# Altium project B153BA.PrjPcb
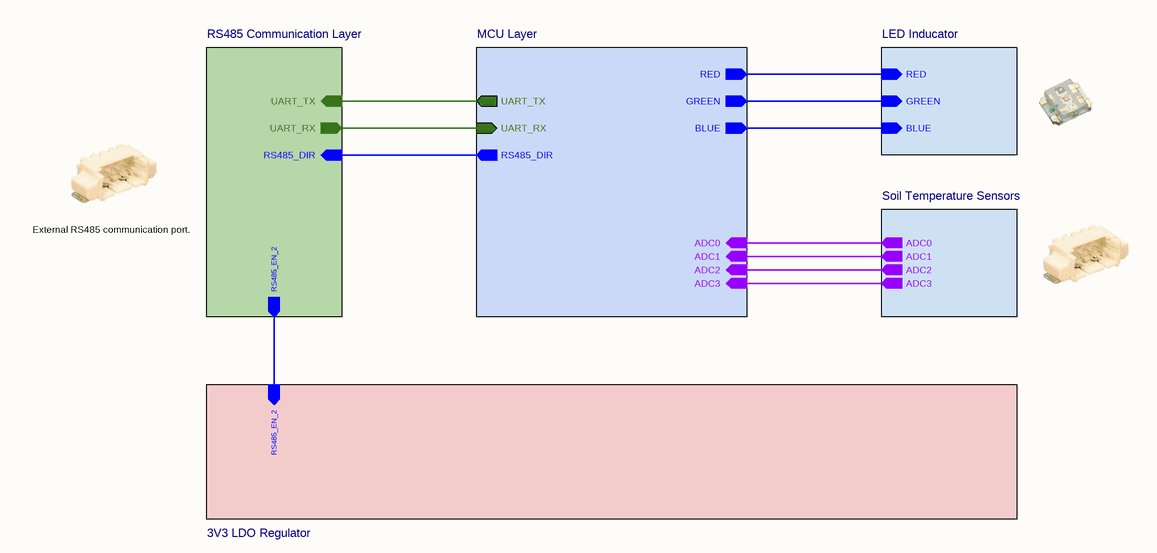
[diagram p0: Block_Diagram.SchDoc]
Address1_: Buyuk Kayacik Mah. 4. OSB; Address2_: 103. Cad. No : 12; Address3_: Selcuklu / Konya; Address4_: Türkiye; Copyright_: Copyright 2022 STF Tarim (Commercial Secret); Customer_: STF Irrigation; Engineer_: Gunce Akkoyun; Git_Repo_Address_: www.github.com/akkoyun/B153AA; Module_ID_: B153AA; Organization_: STF Res-Dev; Product_Desc_: P101DA; Product_ID_: P101DA; Revision_: 00.00.01; Version_: R1
6 sheets, 54 parts. Net scope: hierarchical (ports join the sheet entries above them; power ports are global).
Board file: B153BA.PcbDoc
Sheets:
  Block_Diagram.SchDoc
    RS485 Communication Layer = RS485 Communication Layer.SchDoc
    MCU Layer = MicroController.SchDoc
    Soil Temperature Sensors = Soil Temperature Sensors.SchDoc
    LED Inducator = LED Inducator.SchDoc
    3V3 LDO Regulator = 3V3 LDO Regulator.SchDoc

## Sheet Block_Diagram.SchDoc: B153AA Block Diagram
size 292 x 193 mm; SheetNumber: 1; SheetTotal: 6

### Sub-sheets
3V3 LDO Regulator = 3V3 LDO Regulator.SchDoc: RS485_EN_2 (in)
LED Inducator = LED Inducator.SchDoc: RED (in), BLUE (in), GREEN (in)
MCU Layer = MicroController.SchDoc: UART_TX (out), UART_RX (in), RS485_DIR (out), GREEN (out), RED (out), BLUE (out), ADC1 (in), ADC0 (in), ADC2 (in), ADC3 (in)
RS485 Communication Layer = RS485 Communication Layer.SchDoc: RS485_DIR (in), UART_RX (out), UART_TX (in), RS485_EN_2 (out)
Soil Temperature Sensors = Soil Temperature Sensors.SchDoc: ADC0 (out), ADC1 (out), ADC3 (out), ADC2 (out)

### Nets
ADC0: sheet MCU Layer/ADC0, sheet Soil Temperature Sensors/ADC0
ADC1: sheet MCU Layer/ADC1, sheet Soil Temperature Sensors/ADC1
ADC2: sheet MCU Layer/ADC2, sheet Soil Temperature Sensors/ADC2
ADC3: sheet MCU Layer/ADC3, sheet Soil Temperature Sensors/ADC3
BLUE: sheet MCU Layer/BLUE, sheet LED Inducator/BLUE
GREEN: sheet MCU Layer/GREEN, sheet LED Inducator/GREEN
RED: sheet MCU Layer/RED, sheet LED Inducator/RED
RS485_DIR: sheet RS485 Communication Layer/RS485_DIR, sheet MCU Layer/RS485_DIR
RS485_EN_2: sheet RS485 Communication Layer/RS485_EN_2, sheet 3V3 LDO Regulator/RS485_EN_2
UART_RX: sheet RS485 Communication Layer/UART_RX, sheet MCU Layer/UART_RX
UART_TX: sheet RS485 Communication Layer/UART_TX, sheet MCU Layer/UART_TX

### Notes on the sheet
- External RS485 communication port.
- © 2021 All rights reserved.
  This document may not, in whole or in part, be copied, photocopied, reproduced, translated or converted to any electronic or machine readable from without prior written permission of Mehmet Günce Akkoyun.
  Engineer contact : akkoyun@me.com
- Property of
- Engineer :
- Date :
- Size :
- A4
- Time :
- Project :
- Page :
- /
- Customer :
- Product ID :
- Module ID :
- Version :
- File :
- Revision :

## Sheet RS485 Communication Layer.SchDoc: RS485 Communication Layer
size 292 x 193 mm; SheetNumber: 2; SheetTotal: 5
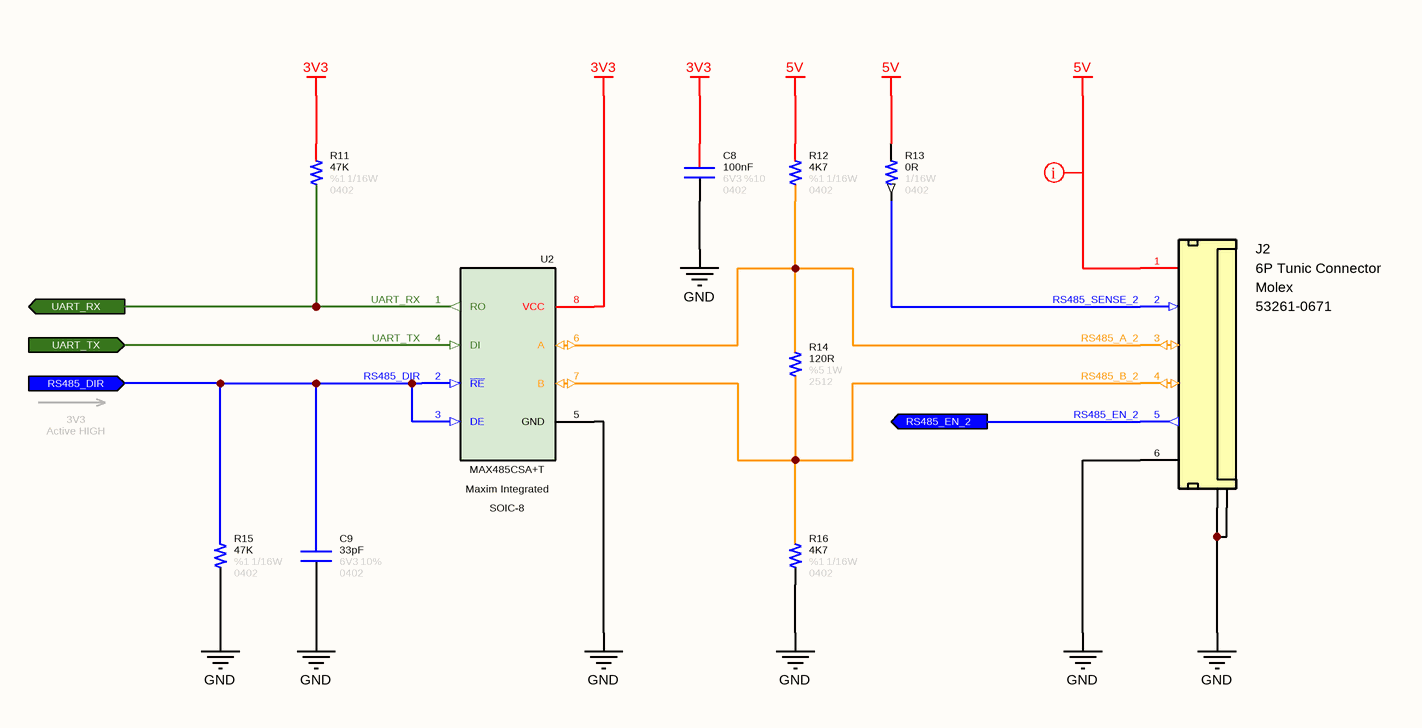
[diagram p1: RS485 Communication Layer.SchDoc]

### Parts
C8  value 100nF  Tolerance: %10  Voltage: 6V3  Case: 0402  [CAPACITOR_0402]  (hidden comment: Capacitor - 100nF [0402] (Ceramic))
C9  value 33pF  Tolerance: 10%  Case: 0402  Voltage: 6V3  [CAPACITOR_0402]  (hidden comment: Capacitor - 33pF [0402] (Ceramic))
J2  6P Tunic Connector  Manufacturer Part Number: 53261-0671  Manufacturer Name: Molex  [Connector_Tunic 6P]
R11  value 47K  Tolerance: %1  Case: 0402  Power: 1/16W  [RESISTOR_0402]  (hidden comment: 47K - 0402 - %1 - 1/16W)
R12  value 4K7  Tolerance: %1  Case: 0402  Power: 1/16W  [RESISTOR_0402]  (hidden comment: 4K7 - 0402 - %1 - 1/16W)
R13  value 0R  Case: 0402  Power: 1/16W  [RESISTOR_0402]  (hidden comment: 0R - 0402 - %1 - 1/16W)
R14  value 120R  Tolerance: %5  Case: 2512  Power: 1W  [RESISTOR_2512]  (hidden comment: 120R - 2512 - %5 - 1W)
R15  value 47K  Tolerance: %1  Case: 0402  Power: 1/16W  [RESISTOR_0402]  (hidden comment: 47K - 0402 - %1 - 1/16W)
R16  value 4K7  Tolerance: %1  Case: 0402  Power: 1/16W  [RESISTOR_0402]  (hidden comment: 4K7 - 0402 - %1 - 1/16W)
U2  Case: SOIC-8  Manufacturer Part Number: MAX485CSA+T  Manufacturer Name: Maxim Integrated  [SOP-8L (AZRS3080E)]  (hidden comment: RS485 Modulator)

### Ports
RS485_DIR (in), RS485_EN_2 (out), UART_RX (out), UART_TX (in)

### Nets
3V3: C8.2 R11.2 U2.8(VCC)
5V: J2.1(5V) R12.2 R13.2
GND: C8.1 C9.1 J2.6(GND) J2.7(GND) J2.8(GND) R15.1 R16.1 U2.5(GND)
RS485_A_2: J2.3(RS485-A) R12.1 R14.2 U2.6(A)
RS485_B_2: J2.4(RS485-B) R14.1 R16.2 U2.7(B)
RS485_DIR: C9.2 R15.2 U2.2(~{RE}) U2.3(DE) ; port RS485_DIR
RS485_EN_2: J2.5(INT) ; port RS485_EN_2
RS485_SENSE_2: J2.2(Sense) R13.1
UART_RX: R11.1 U2.1(RO) ; port UART_RX
UART_TX: U2.4(DI) ; port UART_TX

### Layout directives
rule Supply Nets [Voltage = 5.000]: 5V

### Notes on the sheet
- 3V3
  Active HIGH
- © 2021 All rights reserved.
  This document may not, in whole or in part, be copied, photocopied, reproduced, translated or converted to any electronic or machine readable from without prior written permission of Mehmet Günce Akkoyun.
  Engineer contact : akkoyun@me.com
- Property of
- Engineer :
- Date :
- Size :
- A4
- Time :
- Project :
- Page :
- /
- Customer :
- Product ID :
- Module ID :
- Version :
- File :
- Revision :

### Library data of the parts
C8 = Capacitor - 100nF [0402-6V3]: Capacitor - 100nF [0402-6V3] (Ceramic); Manufacturer Name: AVX; Manufacturer Part Number: 04026D104KAT4A; ComponentLink1Description: Mouser; ComponentLink1URL: https://www.mouser.com.tr/ProductDetail/AVX/04026D104KAT4A?qs=sGAEpiMZZMs0AnBnWHyRQPg4iYkCw7IMED%2F4kpqgf7w%3D; ComponentLink2Description: DataSheet; ComponentLink2URL: https://www.mouser.com.tr/datasheet/2/40/cx5r-776519.pdf
C9 = Capacitor - 33pF [0402-6V3]: Manufacturer Name: Kemet; Manufacturer Part Number: C0402C330J9RACAUTO; ComponentLink1Description: DataSheet; ComponentLink1URL: https://api.kemet.com/component-edge/download/datasheet/C0402C330J9RACAUTO.pdf; ComponentLink2Description: Mouser; ComponentLink2URL: https://www.mouser.com/Search/Refine.aspx?Keyword=80-C0402C330J9RAUTO
J2 = Connector - Mini Tunic 6P (1.25): Mini Tunic Connector with 6P; ROHS: Yes; System: Connector
R11 R15 = Resistor - 47K [0402]: Thick Film Resistors - SMD 1/16 W 47 KOhm 1%; Manufacturer Name: Vishay; Manufacturer Part Number: CRCW040247K0FKED; ComponentLink1Description: DataSheet; ComponentLink1URL: https://www.mouser.com.tr/datasheet/2/427/dcrcwe3-1762152.pdf; ComponentLink2Description: Mouser; ComponentLink2URL: https://www.mouser.com.tr/ProductDetail/Vishay-Dale/CRCW040247K0FKED?qs=sGAEpiMZZMu61qfTUdNhG2DpbjADlD3GL%252B3h1elTxqU%3D
R12 R16 = Resistor - 4K7 [0402]: Thick Film Resistors - SMD 1/16 W 4.7 KOhm 1%; Manufacturer Name: Vishay; Manufacturer Part Number: CRCW04024K70FKED; ComponentLink1Description: DataSheet; ComponentLink1URL: https://www.mouser.com.tr/datasheet/2/427/dcrcwe3-1762152.pdf; ComponentLink2Description: Mouser; ComponentLink2URL: https://www.mouser.com.tr/ProductDetail/Vishay-Dale/CRCW04024K70FKED?qs=sGAEpiMZZMu61qfTUdNhG7nHf%2F6MTUn3HadIdDQu24Q%3D
R13 = Resistor - 0R [0402]: Thick Film Resistors - SMD 1/16 W 0 Ohm; Manufacturer Name: Vishay; Manufacturer Part Number: CRCW04020000Z0ED; ComponentLink1Description: DataSheet; ComponentLink1URL: https://www.mouser.com.tr/datasheet/2/427/dcrcwe3-1762152.pdf; ComponentLink2Description: Mouser; ComponentLink2URL: https://www.mouser.com.tr/ProductDetail/Vishay-Dale/CRCW04020000Z0ED?qs=sGAEpiMZZMu61qfTUdNhG2DpbjADlD3GG34cJb50zyg%3D
R14 = Resistor - 120R [2512]: Thick Film Resistors - SMD 1 W 120 Ohm 5%; Manufacturer Name: YAGEO; Manufacturer Part Number: RC2512JK-07120RL; ComponentLink1Description: DataSheet; ComponentLink1URL: https://www.mouser.com.tr/datasheet/2/447/PYu_RC_Group_51_RoHS_L_11-1984063.pdf
U2 = IC - MAX485CSA+T: RS-422/RS-485 Interface IC Low-Power, Slew-Rate-Limited RS-485/RS-422 Transceivers; RoHS: Yes

## Sheet MicroController.SchDoc: MicroController
size 292 x 193 mm; SheetNumber: 4; SheetTotal: 6
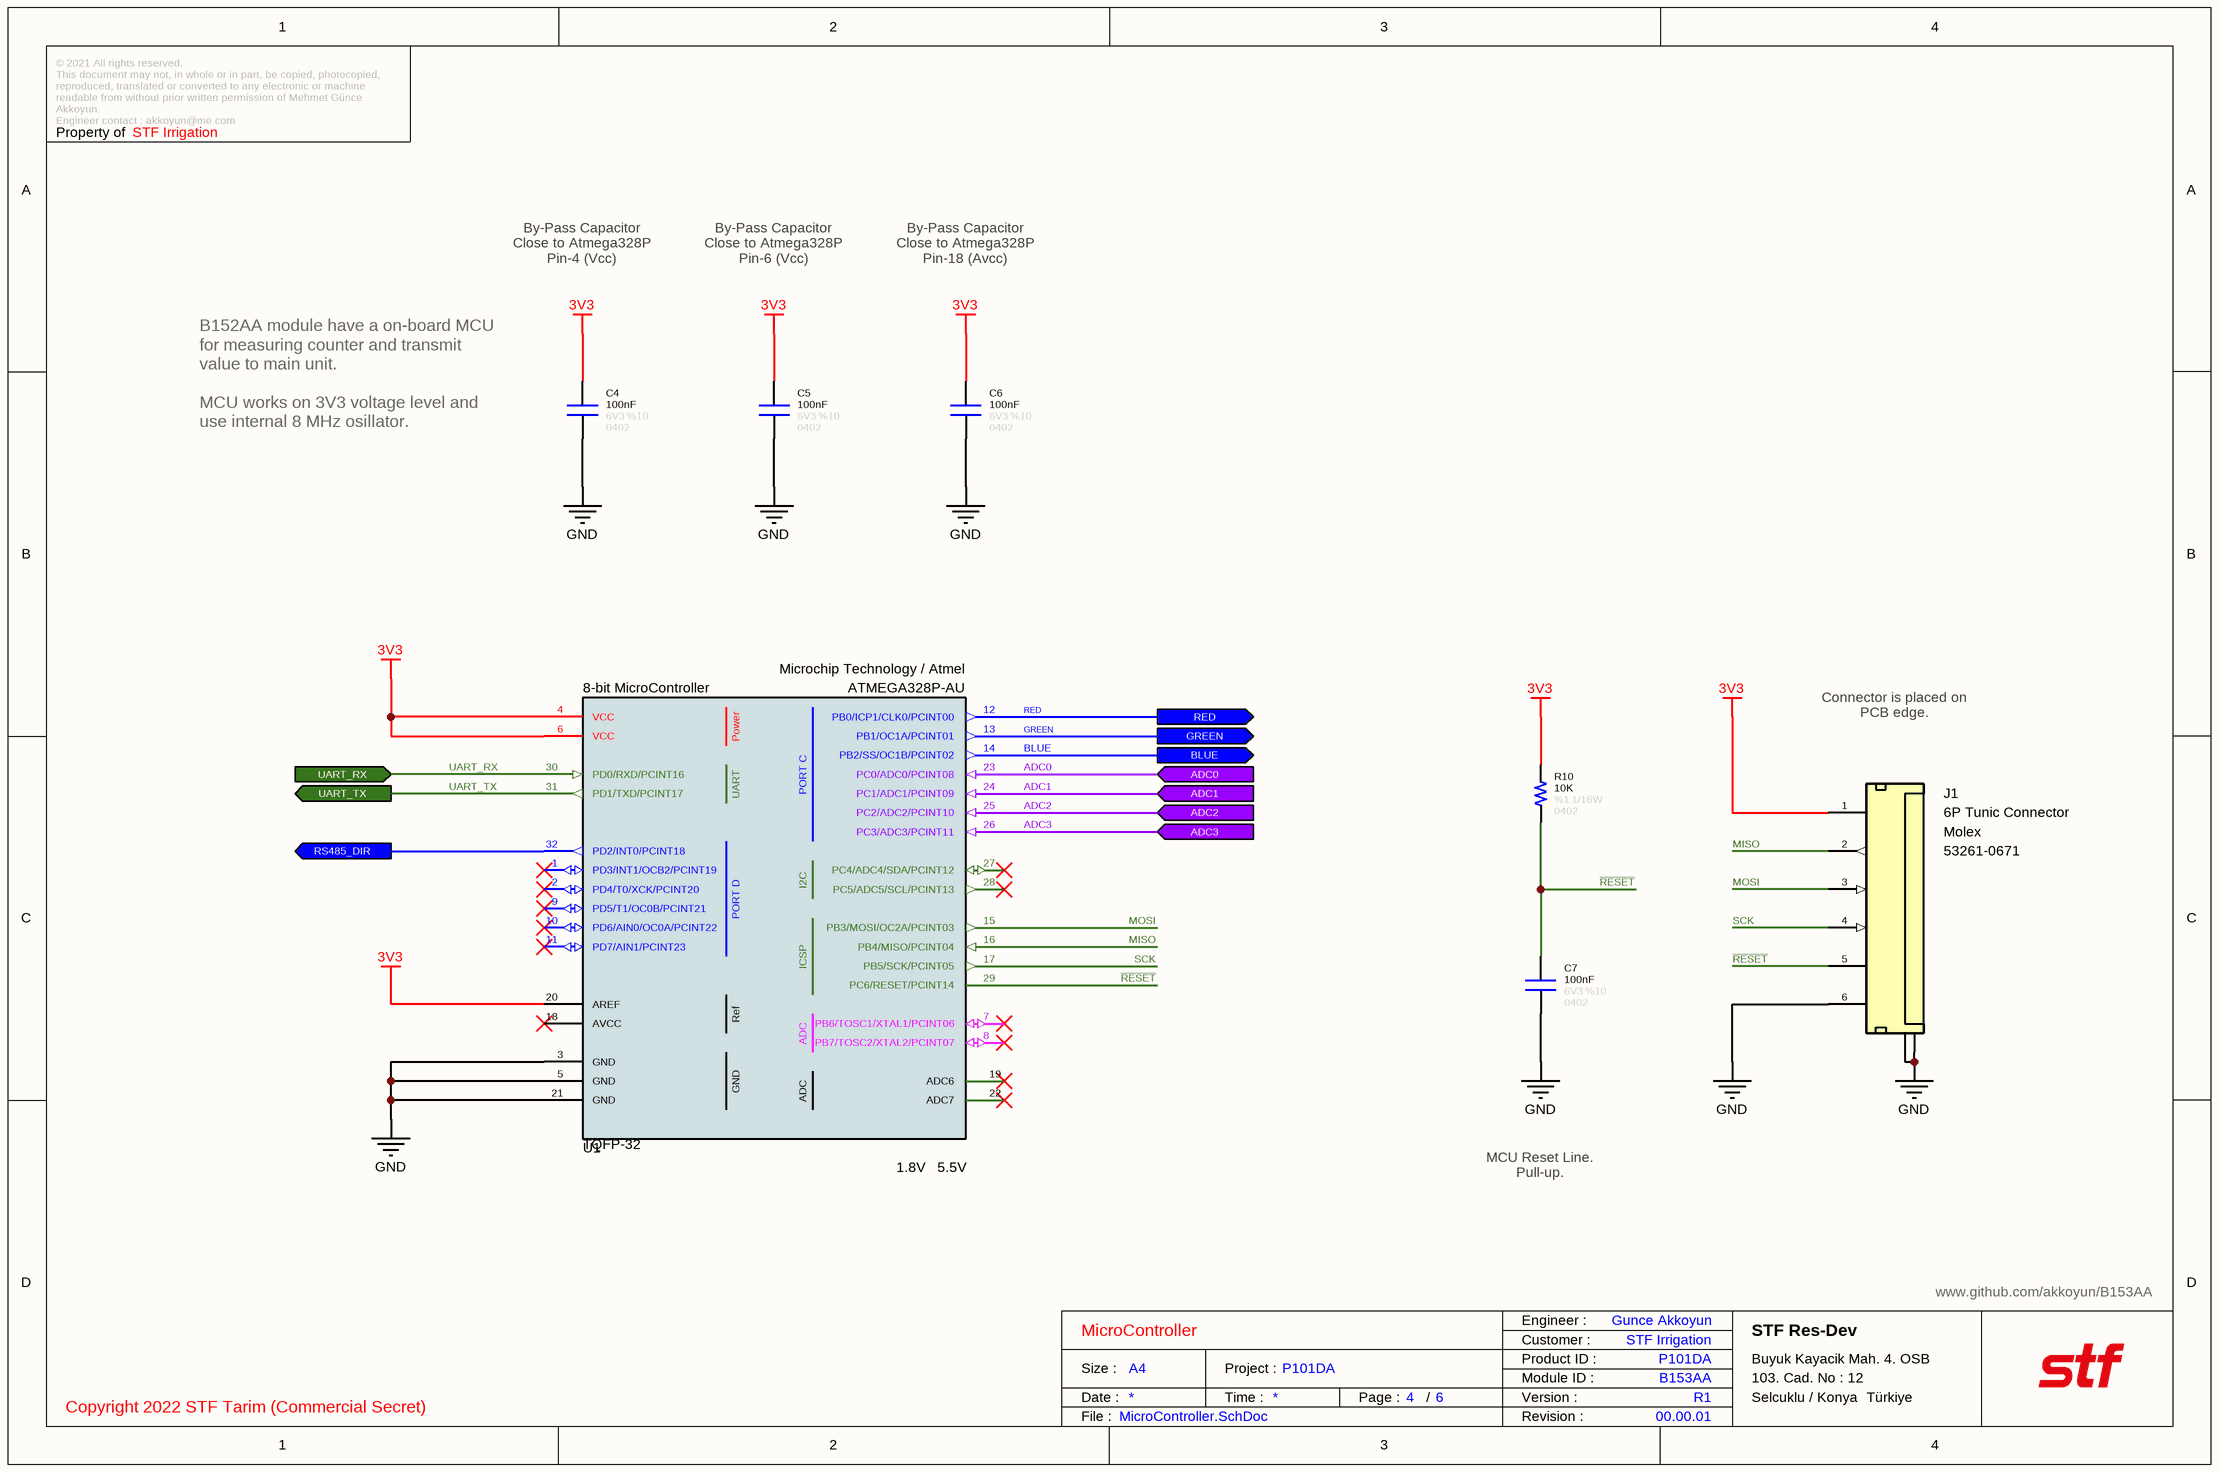
[diagram p2: MicroController.SchDoc]

### Parts
C4  value 100nF  Tolerance: %10  Voltage: 6V3  Case: 0402  [CAPACITOR_0402]  (hidden comment: Capacitor - 100nF [0402] (Ceramic))
C5  value 100nF  Tolerance: %10  Voltage: 6V3  Case: 0402  [CAPACITOR_0402]  (hidden comment: Capacitor - 100nF [0402] (Ceramic))
C6  value 100nF  Tolerance: %10  Voltage: 6V3  Case: 0402  [CAPACITOR_0402]  (hidden comment: Capacitor - 100nF [0402] (Ceramic))
C7  value 100nF  Tolerance: %10  Voltage: 6V3  Case: 0402  [CAPACITOR_0402]  (hidden comment: Capacitor - 100nF [0402] (Ceramic))
J1  6P Tunic Connector  Manufacturer Part Number: 53261-0671  Manufacturer Name: Molex  [Connector_Tunic 6P]
R10  value 10K  Tolerance: %1  Case: 0402  Power: 1/16W  [RESISTOR_0402]  (hidden comment: 10K - 0402 - %1 - 1/16W)
U1  8-bit MicroController  Supply Voltage - Max: 5.5V  Supply Voltage - Min: 1.8V  Manufacturer Name: Microchip Technology / Atmel  Manufacturer Part Number: ATMEGA328P-AU  Case: TQFP-32  [TQFN-32]

### Ports
ADC0 (in), ADC1 (in), ADC2 (in), ADC3 (in), BLUE (out), GREEN (out), RED (out), RS485_DIR (out), UART_RX (in), UART_TX (out)

### Nets
3V3: C4.2 C5.2 C6.2 J1.1(VBAT) R10.2 U1.4(VCC) U1.6(VCC) U1.20(AREF)
GND: C4.1 C5.1 C6.1 C7.1 J1.6(M_DRV) J1.7(GND) J1.8(GND) U1.3(GND) U1.5(GND) U1.21(GND)
ADC0: U1.23(PC0/ADC0/PCINT08) ; port ADC0
ADC1: U1.24(PC1/ADC1/PCINT09) ; port ADC1
ADC2: U1.25(PC2/ADC2/PCINT10) ; port ADC2
ADC3: U1.26(PC3/ADC3/PCINT11) ; port ADC3
BLUE: U1.14(PB2/SS/OC1B/PCINT02) ; port BLUE
GREEN: U1.13(PB1/OC1A/PCINT01) ; port GREEN
MISO: J1.2(M_DRV) U1.16(PB4/MISO/PCINT04)
MOSI: J1.3(M_DRV) U1.15(PB3/MOSI/OC2A/PCINT03)
~{RESET}: C7.2 J1.5(M_DRV) R10.1 U1.29(PC6/RESET/PCINT14)
RED: U1.12(PB0/ICP1/CLK0/PCINT00) ; port RED
RS485_DIR: U1.32(PD2/INT0/PCINT18) ; port RS485_DIR
SCK: J1.4(M_DRV) U1.17(PB5/SCK/PCINT05)
UART_RX: U1.30(PD0/RXD/PCINT16) ; port UART_RX
UART_TX: U1.31(PD1/TXD/PCINT17) ; port UART_TX

Not connected (* = marked no-connect by the designer): U1 1(PD3/INT1/OCB2/PCINT19)* 2(PD4/T0/XCK/PCINT20)* 7(PB6/TOSC1/XTAL1/PCINT06)* 8(PB7/TOSC2/XTAL2/PCINT07)* 9(PD5/T1/OC0B/PCINT21)* 10(PD6/AIN0/OC0A/PCINT22)* 11(PD7/AIN1/PCINT23)* 18(AVCC)* 19(ADC6)* 22(ADC7)* 27(PC4/ADC4/SDA/PCINT12)* 28(PC5/ADC5/SCL/PCINT13)*

### Notes on the sheet
- By-Pass Capacitor
  Close to Atmega328P
  Pin-4 (Vcc)
- By-Pass Capacitor
  Close to Atmega328P
  Pin-6 (Vcc)
- By-Pass Capacitor
  Close to Atmega328P
  Pin-18 (Avcc)
- B152AA module have a on-board MCU for measuring counter and transmit value to main unit.
  MCU works on 3V3 voltage level and use internal 8 MHz osillator.
- Connector is placed on PCB edge.
- MCU Reset Line. Pull-up.
- © 2021 All rights reserved.
  This document may not, in whole or in part, be copied, photocopied, reproduced, translated or converted to any electronic or machine readable from without prior written permission of Mehmet Günce Akkoyun.
  Engineer contact : akkoyun@me.com
- Property of
- Engineer :
- Date :
- Size :
- A4
- Time :
- Project :
- Page :
- /
- Customer :
- Product ID :
- Module ID :
- Version :
- File :
- Revision :
- (in symbol IC - ATMEGA328P-AU) Power; PORT C; UART; I2C; PORT D; ICSP; Ref; ADC

### Library data of the parts
C4-C7 = Capacitor - 100nF [0402-6V3]: as C8 on sheet RS485 Communication Layer; ComponentLink1Description: Mouser; ComponentLink1URL: https://www.mouser.com.tr/ProductDetail/AVX/04026D104KAT4A?qs=sGAEpiMZZMs0AnBnWHyRQPg4iYkCw7IMED%2F4kpqgf7w%3D; ComponentLink2Description: DataSheet; ComponentLink2URL: https://www.mouser.com.tr/datasheet/2/40/cx5r-776519.pdf
J1 = Connector - Mini Tunic 6P (1.25): Mini Tunic Connector with 6P; ROHS: Yes
R10 = Resistor - 10K [0402]: Thick Film Resistors - SMD 1/16 W 10 KOhm 1%; Manufacturer Name: Vishay; Manufacturer Part Number: CRCW040210K0FKED; ComponentLink1Description: DataSheet; ComponentLink1URL: https://www.mouser.com.tr/datasheet/2/427/dcrcwe3-1762152.pdf; ComponentLink2Description: Mouser; ComponentLink2URL: https://www.mouser.com.tr/ProductDetail/Vishay-Dale/CRCW040210K0FKED?qs=sGAEpiMZZMu61qfTUdNhG2DpbjADlD3GcalbOv9utCY%3D
U1 = IC - ATMEGA328P-AU: 8-bit Microcontrollers - MCU 32KB In-system Flash 20MHz 1.8V-5.5V; Height: 1mm; ComponentLink1Description: DataSheet; ComponentLink1URL: http://ww1.microchip.com/downloads/en/DeviceDoc/ATmega48A-PA-88A-PA-168A-PA-328-P-DS-DS40002061A.pdf; ROHS: Yes; Minimum Operating Temperature: -40; Maximum Operating Temperature: +85; ComponentLink2Description: Mouser; ComponentLink2URL: https://www.mouser.com.tr/ProductDetail/Microchip-Technology-Atmel/ATMEGA328P-AU?qs=sGAEpiMZZMtVoztFdqDXO3RbBx7FKCmV; ComponentLink3Description: ProductPage; ComponentLink3URL: https://www.microchip.com/wwwproducts/en/ATmega328p

## Sheet Soil Temperature Sensors.SchDoc: Soil Temperature Sensors
size 292 x 193 mm; SheetNumber: 6; SheetTotal: 5
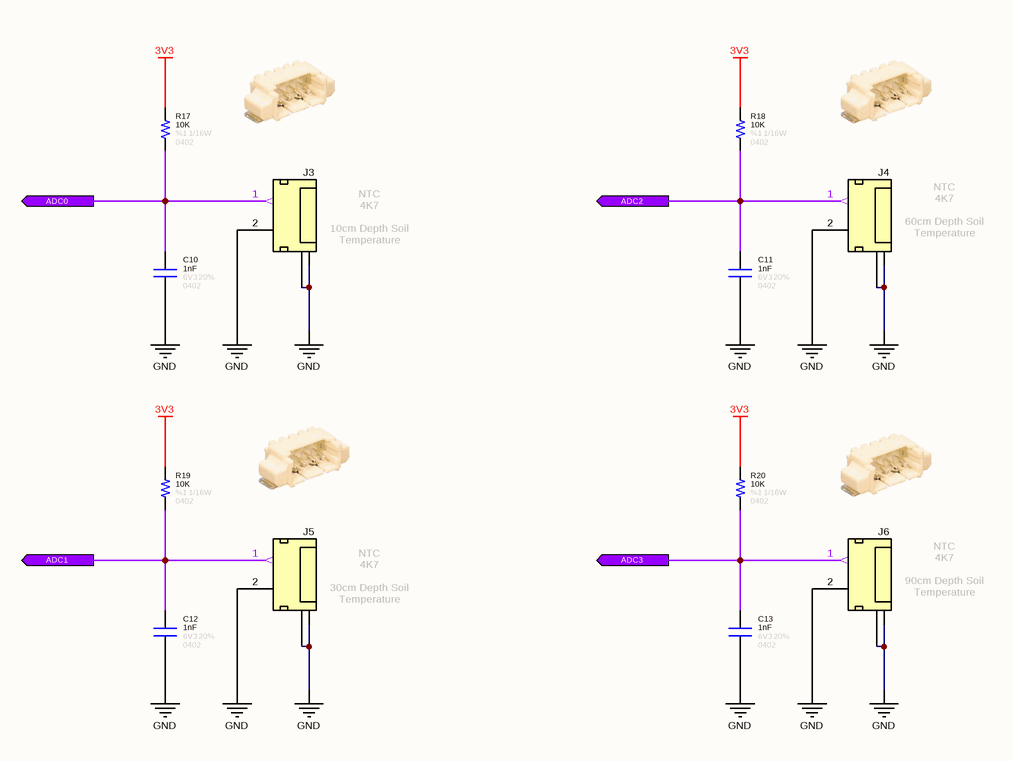
[diagram p3: Soil Temperature Sensors.SchDoc]

### Parts
C10  value 1nF  Tolerance: 20%  Case: 0402  Voltage: 6V3  [CAPACITOR_0402]  (hidden comment: Capacitor - 1nF [0402] (Ceramic))
C11  value 1nF  Tolerance: 20%  Case: 0402  Voltage: 6V3  [CAPACITOR_0402]  (hidden comment: Capacitor - 1nF [0402] (Ceramic))
C12  value 1nF  Tolerance: 20%  Case: 0402  Voltage: 6V3  [CAPACITOR_0402]  (hidden comment: Capacitor - 1nF [0402] (Ceramic))
C13  value 1nF  Tolerance: 20%  Case: 0402  Voltage: 6V3  [CAPACITOR_0402]  (hidden comment: Capacitor - 1nF [0402] (Ceramic))
J3  2P SMD Tunic Connector  [Connector_Tunic 2P]  (value not drawn)
J4  2P SMD Tunic Connector  [Connector_Tunic 2P]  (value not drawn)
J5  2P SMD Tunic Connector  [Connector_Tunic 2P]  (value not drawn)
J6  2P SMD Tunic Connector  [Connector_Tunic 2P]  (value not drawn)
R17  value 10K  Tolerance: %1  Case: 0402  Power: 1/16W  [RESISTOR_0402]  (hidden comment: 10K - 0402 - %1 - 1/16W)
R18  value 10K  Tolerance: %1  Case: 0402  Power: 1/16W  [RESISTOR_0402]  (hidden comment: 10K - 0402 - %1 - 1/16W)
R19  value 10K  Tolerance: %1  Case: 0402  Power: 1/16W  [RESISTOR_0402]  (hidden comment: 10K - 0402 - %1 - 1/16W)
R20  value 10K  Tolerance: %1  Case: 0402  Power: 1/16W  [RESISTOR_0402]  (hidden comment: 10K - 0402 - %1 - 1/16W)

### Ports
ADC0 (out), ADC1 (out), ADC2 (out), ADC3 (out)

### Nets
3V3: R17.2 R18.2 R19.2 R20.2
GND: C10.1 C11.1 C12.1 C13.1 J3.2(Pin2) J3.3(GND) J3.4(GND) J4.2(Pin2) J4.3(GND) J4.4(GND) J5.2(Pin2) J5.3(GND) J5.4(GND) J6.2(Pin2) J6.3(GND) J6.4(GND)
ADC0: C10.2 J3.1(Pin1) R17.1 ; port ADC0
ADC1: C12.2 J5.1(Pin1) R19.1 ; port ADC1
ADC2: C11.2 J4.1(Pin1) R18.1 ; port ADC2
ADC3: C13.2 J6.1(Pin1) R20.1 ; port ADC3

### Notes on the sheet
- (near J3) NTC
  4K7
  10cm Depth Soil Temperature
- (near J4) NTC
  4K7
  60cm Depth Soil Temperature
- (near J5) NTC
  4K7
  30cm Depth Soil Temperature
- (near J6) NTC
  4K7
  90cm Depth Soil Temperature
- © 2021 All rights reserved.
  This document may not, in whole or in part, be copied, photocopied, reproduced, translated or converted to any electronic or machine readable from without prior written permission of Mehmet Günce Akkoyun.
  Engineer contact : akkoyun@me.com
- Property of
- Engineer :
- Date :
- Size :
- A4
- Time :
- Project :
- Page :
- /
- Customer :
- Product ID :
- Module ID :
- Version :
- File :
- Revision :

### Library data of the parts
C10-C13 = Capacitor - 1nF [0402-6V3]: Manufacturer Name: AVX; Manufacturer Part Number: 04026C102MAT2A; ComponentLink1Description: DataSheet; ComponentLink1URL: https://www.mouser.com.tr/datasheet/2/40/X7RDielectric-777024.pdf
J3-J6 = Connector - Mini Tunic 2P (1.25): Mini Tunic Connector with 2P; Manufacturer Name: Molex; Manufacturer Part Number: 53261-0271; Height: 3.55mm; Mouser Part Number: 538-53261-0271; ROHS: Yes
R17-R20 = Resistor - 10K [0402]: as R10 on sheet MicroController; ComponentLink1Description: DataSheet; ComponentLink1URL: https://www.mouser.com.tr/datasheet/2/427/dcrcwe3-1762152.pdf; ComponentLink2Description: Mouser; ComponentLink2URL: https://www.mouser.com.tr/ProductDetail/Vishay-Dale/CRCW040210K0FKED?qs=sGAEpiMZZMu61qfTUdNhG2DpbjADlD3GcalbOv9utCY%3D

## Sheet LED Inducator.SchDoc: MCU LED Layer
size 292 x 193 mm; SheetNumber: 5; SheetTotal: 5
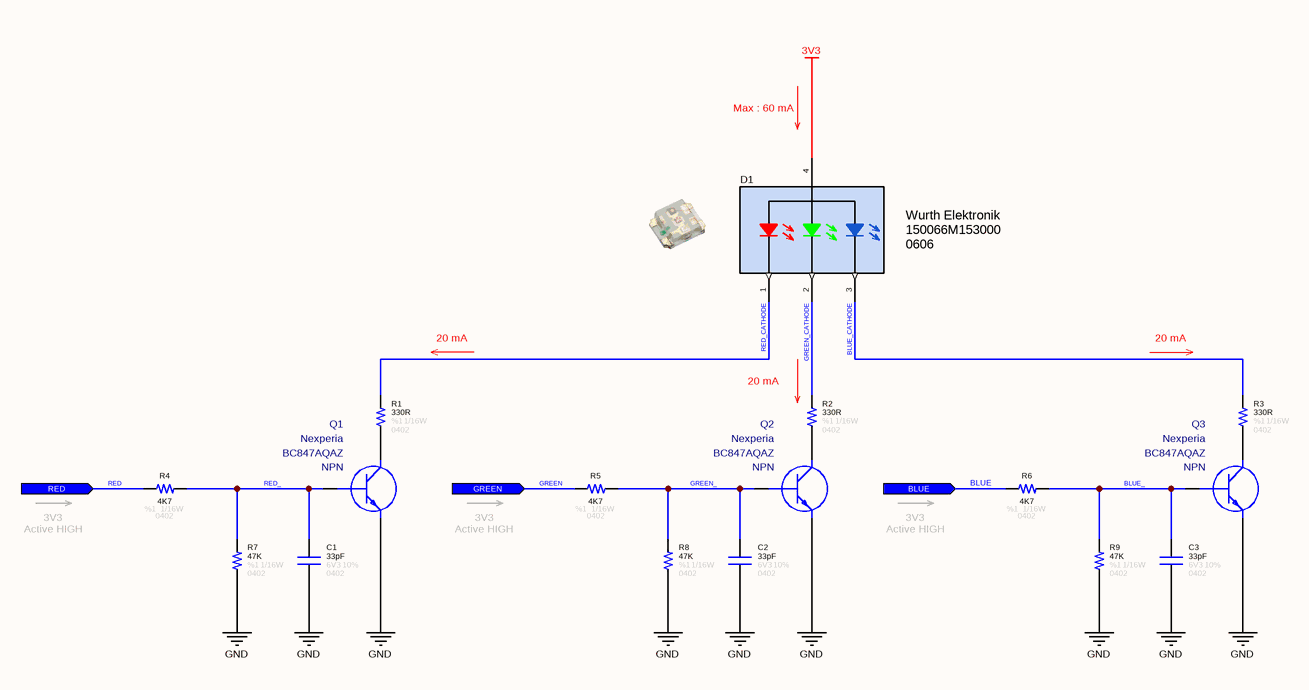
[diagram p4: LED Inducator.SchDoc]

### Parts
C1  value 33pF  Tolerance: 10%  Case: 0402  Voltage: 6V3  [CAPACITOR_0402]  (hidden comment: Capacitor - 33pF [0402] (Ceramic))
C2  value 33pF  Tolerance: 10%  Case: 0402  Voltage: 6V3  [CAPACITOR_0402]  (hidden comment: Capacitor - 33pF [0402] (Ceramic))
C3  value 33pF  Tolerance: 10%  Case: 0402  Voltage: 6V3  [CAPACITOR_0402]  (hidden comment: Capacitor - 33pF [0402] (Ceramic))
D1  Manufacturer Name: Wurth Elektronik  Case: 0606  [Wurth_0606]  (hidden comment: 150066M153000)
Q1  Manufacturer Name: Nexperia  Polarity: NPN  [SOT1215]  (hidden comment: BC847AQAZ)
Q2  Manufacturer Name: Nexperia  Polarity: NPN  [SOT1215]  (hidden comment: BC847AQAZ)
Q3  Manufacturer Name: Nexperia  Polarity: NPN  [SOT1215]  (hidden comment: BC847AQAZ)
R1  value 330R  Case: 0402  Tolerance: %1  Power: 1/16W  [RESISTOR_0402]  (hidden comment: 330R - 0402 - %1 - 1/16W)
R2  value 330R  Case: 0402  Tolerance: %1  Power: 1/16W  [RESISTOR_0402]  (hidden comment: 330R - 0402 - %1 - 1/16W)
R3  value 330R  Case: 0402  Tolerance: %1  Power: 1/16W  [RESISTOR_0402]  (hidden comment: 330R - 0402 - %1 - 1/16W)
R4  value 4K7  Tolerance: %1  Case: 0402  Power: 1/16W  [RESISTOR_0402]  (hidden comment: 4K7 - 0402 - %1 - 1/16W)
R5  value 4K7  Tolerance: %1  Case: 0402  Power: 1/16W  [RESISTOR_0402]  (hidden comment: 4K7 - 0402 - %1 - 1/16W)
R6  value 4K7  Tolerance: %1  Case: 0402  Power: 1/16W  [RESISTOR_0402]  (hidden comment: 4K7 - 0402 - %1 - 1/16W)
R7  value 47K  Tolerance: %1  Case: 0402  Power: 1/16W  [RESISTOR_0402]  (hidden comment: 47K - 0402 - %1 - 1/16W)
R8  value 47K  Tolerance: %1  Case: 0402  Power: 1/16W  [RESISTOR_0402]  (hidden comment: 47K - 0402 - %1 - 1/16W)
R9  value 47K  Tolerance: %1  Case: 0402  Power: 1/16W  [RESISTOR_0402]  (hidden comment: 47K - 0402 - %1 - 1/16W)

### Ports
BLUE (in), GREEN (in), RED (in)

### Nets
3V3: D1.4
GND: C1.1 C2.1 C3.1 Q1.2(E) Q2.2(E) Q3.2(E) R7.1 R8.1 R9.1
BLUE: R6.2 ; port BLUE
BLUE_: C3.2 Q3.1(B) R6.1 R9.2
BLUE_CATHODE: D1.3 R3.2
GREEN: R5.2 ; port GREEN
GREEN_: C2.2 Q2.1(B) R5.1 R8.2
GREEN_CATHODE: D1.2 R2.2
RED: R4.2 ; port RED
RED_: C1.2 Q1.1(B) R4.1 R7.2
RED_CATHODE: D1.1 R1.2
NetQ1_3: Q1.3(C) R1.1
NetQ2_3: Q2.3(C) R2.1
NetQ3_3: Q3.3(C) R3.1

### Notes on the sheet
- Max : 60 mA
- 20 mA
- (near R2) 20 mA
- 3V3
  Active HIGH
- © 2021 All rights reserved.
  This document may not, in whole or in part, be copied, photocopied, reproduced, translated or converted to any electronic or machine readable from without prior written permission of Mehmet Günce Akkoyun.
  Engineer contact : akkoyun@me.com
- Property of
- Engineer :
- Date :
- Size :
- A4
- Time :
- Project :
- Page :
- /
- Customer :
- Product ID :
- Module ID :
- Version :
- File :
- Revision :

### Library data of the parts
C1-C3 = Capacitor - 33pF [0402-6V3]: as C9 on sheet RS485 Communication Layer; ComponentLink1Description: DataSheet; ComponentLink1URL: https://api.kemet.com/component-edge/download/datasheet/C0402C330J9RACAUTO.pdf; ComponentLink2Description: Mouser; ComponentLink2URL: https://www.mouser.com/Search/Refine.aspx?Keyword=80-C0402C330J9RAUTO
D1 = Diode - LED-RGB: LED RGB DIFFUSED SMD; If - Forward Current: 20 mA; Vf - Forward Voltage: 2 V, 3.3 V; Product Type: LED; Minimum Operating Temperature: - 40 C; Maximum Operating Temperature: + 85 C; ROHS: Yes; Manufacturer Part Number: 150066M153000
Q1-Q3 = Transistor - BC847: Bipolar NPN Transistors; Case: DFN-1010D-3; Manufacturer Part Number: BC847AQAZ
R1-R3 = Resistor - 330R [0402]: Thick Film Resistors - SMD 1/16 W 330 Ohm 1%; Manufacturer Name: Vishay; Manufacturer Part Number: CRCW0402330RFKED; ComponentLink1Description: DataSheet; ComponentLink1URL: https://www.mouser.com.tr/datasheet/2/427/dcrcwe3-1762152.pdf; ComponentLink2Description: Mouser; ComponentLink2URL: https://www.mouser.com.tr/ProductDetail/Vishay-Dale/CRCW0402330RFKED?qs=sGAEpiMZZMu61qfTUdNhG2DpbjADlD3GGS6SwBlLi5Q%3D
R4-R6 = Resistor - 4K7 [0402]: as R12 on sheet RS485 Communication Layer; ComponentLink1Description: DataSheet; ComponentLink1URL: https://www.mouser.com.tr/datasheet/2/427/dcrcwe3-1762152.pdf; ComponentLink2Description: Mouser; ComponentLink2URL: https://www.mouser.com.tr/ProductDetail/Vishay-Dale/CRCW04024K70FKED?qs=sGAEpiMZZMu61qfTUdNhG7nHf%2F6MTUn3HadIdDQu24Q%3D
R7-R9 = Resistor - 47K [0402]: as R11 on sheet RS485 Communication Layer; ComponentLink1Description: DataSheet; ComponentLink1URL: https://www.mouser.com.tr/datasheet/2/427/dcrcwe3-1762152.pdf; ComponentLink2Description: Mouser; ComponentLink2URL: https://www.mouser.com.tr/ProductDetail/Vishay-Dale/CRCW040247K0FKED?qs=sGAEpiMZZMu61qfTUdNhG2DpbjADlD3GL%252B3h1elTxqU%3D

## Sheet 3V3 LDO Regulator.SchDoc: 3V3 Regulator
size 292 x 193 mm; SheetNumber: 3; SheetTotal: 6
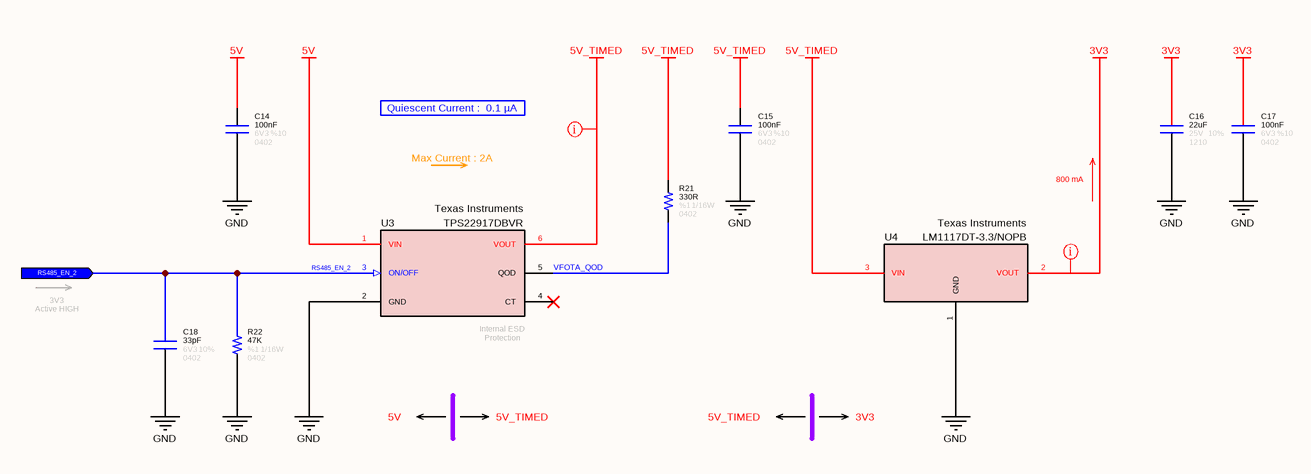
[diagram p5: 3V3 LDO Regulator.SchDoc]

### Parts
C14  value 100nF  Tolerance: %10  Voltage: 6V3  Case: 0402  [CAPACITOR_0402]  (hidden comment: Capacitor - 100nF [0402] (Ceramic))
C15  value 100nF  Tolerance: %10  Voltage: 6V3  Case: 0402  [CAPACITOR_0402]  (hidden comment: Capacitor - 100nF [0402] (Ceramic))
C16  value 22uF  Tolerance: 10%  Case: 1210  Voltage: 25V  [CAPACITOR_0603]  (hidden comment: Capacitor - 22uF [1210] (Ceramic))
C17  value 100nF  Tolerance: %10  Voltage: 6V3  Case: 0402  [CAPACITOR_0402]  (hidden comment: Capacitor - 100nF [0402] (Ceramic))
C18  value 33pF  Tolerance: 10%  Case: 0402  Voltage: 6V3  [CAPACITOR_0402]  (hidden comment: Capacitor - 33pF [0402] (Ceramic))
R21  value 330R  Case: 0402  Tolerance: %1  Power: 1/16W  [RESISTOR_0402]  (hidden comment: 330R - 0402 - %1 - 1/16W)
R22  value 47K  Tolerance: %1  Case: 0402  Power: 1/16W  [RESISTOR_0402]  (hidden comment: 47K - 0402 - %1 - 1/16W)
U3  Manufacturer Part Number: TPS22917DBVR  Manufacturer Name: Texas Instruments  [SOT-23-6]  (hidden comment: Power Switch)
U4  Manufacturer Part Number: LM1117DT-3.3/NOPB  Manufacturer Name: Texas Instruments  [TO-252]  (hidden comment: LDO Regulator)

### Ports
RS485_EN_2 (in)

### Nets
3V3: C16.2 C17.2 U4.2(VOUT)
5V: C14.2 U3.1(VIN)
5V_TIMED: C15.2 R21.2 U3.6(VOUT) U4.3(VIN)
GND: C14.1 C15.1 C16.1 C17.1 C18.1 R22.1 U3.2(GND) U4.1(GND)
RS485_EN_2: C18.2 R22.2 U3.3(ON/OFF) ; port RS485_EN_2
VFOTA_QOD: R21.1 U3.5(QOD)

Not connected (* = marked no-connect by the designer): U3 4(CT)*

### Layout directives
rule Supply Nets [Voltage = 3.300]: 3V3
rule Supply Nets [Voltage = 5.170]: 5V_TIMED

### Notes on the sheet
- Quiescent Current :  0.1 µA
- Max Current : 2A
- 800 mA
- 3V3
  Active HIGH
- (near U3) Internal ESD Protection
- 5V
- 5V_TIMED
- 3V3
- © 2022 All rights reserved.
  This document may not, in whole or in part, be copied, photocopied, reproduced, translated or converted to any electronic or machine readable from without prior written permission of Mehmet Günce Akkoyun.
  Engineer contact : akkoyun@me.com
- Property of
- Engineer :
- Date :
- Size :
- A4
- Time :
- Project :
- Page :
- /
- Customer :
- Product ID :
- Module ID :
- Version :
- File :
- Revision :

### Library data of the parts
C14 C15 C17 = Capacitor - 100nF [0402-6V3]: as C8 on sheet RS485 Communication Layer; ComponentLink1Description: Mouser; ComponentLink1URL: https://www.mouser.com.tr/ProductDetail/AVX/04026D104KAT4A?qs=sGAEpiMZZMs0AnBnWHyRQPg4iYkCw7IMED%2F4kpqgf7w%3D; ComponentLink2Description: DataSheet; ComponentLink2URL: https://www.mouser.com.tr/datasheet/2/40/cx5r-776519.pdf
C16 = Capacitor - 22uF [1210-6V3]: Multilayer Ceramic Capacitors MLCC - SMD/SMT 22UF 25V 10% 1210; Manufacturer Part Number: GRM32ER71E226KE15L; Manufacturer Name: Murata
C18 = Capacitor - 33pF [0402-6V3]: as C9 on sheet RS485 Communication Layer; ComponentLink1Description: DataSheet; ComponentLink1URL: https://api.kemet.com/component-edge/download/datasheet/C0402C330J9RACAUTO.pdf; ComponentLink2Description: Mouser; ComponentLink2URL: https://www.mouser.com/Search/Refine.aspx?Keyword=80-C0402C330J9RAUTO
R21 = Resistor - 330R [0402]: as R1 on sheet LED Inducator; ComponentLink1Description: DataSheet; ComponentLink1URL: https://www.mouser.com.tr/datasheet/2/427/dcrcwe3-1762152.pdf; ComponentLink2Description: Mouser; ComponentLink2URL: https://www.mouser.com.tr/ProductDetail/Vishay-Dale/CRCW0402330RFKED?qs=sGAEpiMZZMu61qfTUdNhG2DpbjADlD3GGS6SwBlLi5Q%3D
R22 = Resistor - 47K [0402]: as R11 on sheet RS485 Communication Layer; ComponentLink1Description: DataSheet; ComponentLink1URL: https://www.mouser.com.tr/datasheet/2/427/dcrcwe3-1762152.pdf; ComponentLink2Description: Mouser; ComponentLink2URL: https://www.mouser.com.tr/ProductDetail/Vishay-Dale/CRCW040247K0FKED?qs=sGAEpiMZZMu61qfTUdNhG2DpbjADlD3GL%252B3h1elTxqU%3D
U3 = IC - TPS22917: Power Switch MosFet; Height: 1.45mm; ComponentLink1Description: DataSheet; ComponentLink1URL: http://www.ti.com/lit/gpn/tps22917; ComponentLink2Description: Mouser; ComponentLink2URL: https://www.mouser.com/Search/Refine.aspx?Keyword=595-TPS22917DBVR; Case: SOT-23-6
U4 = IC - LM1117DT-3.3/NOPB: LDO Voltage Regulators 800MA LDO LINEAR REG; Case: TO-252-3

## Nets that join several sheets
3V3: RS485 Communication Layer (C8.2 R11.2 U2.8), MicroController (8 pins), Soil Temperature Sensors (R17.2 R18.2 R19.2 R20.2), LED Inducator (D1.4), 3V3 LDO Regulator (C16.2 C17.2 U4.2)
5V: RS485 Communication Layer (J2.1 R12.2 R13.2), 3V3 LDO Regulator (C14.2 U3.1)
GND: RS485 Communication Layer (8 pins), MicroController (10 pins), Soil Temperature Sensors (16 pins), LED Inducator (9 pins), 3V3 LDO Regulator (8 pins)
ADC0: MicroController (U1.23), Soil Temperature Sensors (C10.2 J3.1 R17.1)
ADC1: MicroController (U1.24), Soil Temperature Sensors (C12.2 J5.1 R19.1)
ADC2: MicroController (U1.25), Soil Temperature Sensors (C11.2 J4.1 R18.1)
ADC3: MicroController (U1.26), Soil Temperature Sensors (C13.2 J6.1 R20.1)
BLUE: MicroController (U1.14), LED Inducator (R6.2)
GREEN: MicroController (U1.13), LED Inducator (R5.2)
RED: MicroController (U1.12), LED Inducator (R4.2)
RS485_DIR: RS485 Communication Layer (C9.2 R15.2 U2.2 U2.3), MicroController (U1.32)
RS485_EN_2: RS485 Communication Layer (J2.5), 3V3 LDO Regulator (C18.2 R22.2 U3.3)
UART_RX: RS485 Communication Layer (R11.1 U2.1), MicroController (U1.30)
UART_TX: RS485 Communication Layer (U2.4), MicroController (U1.31)